# Altium schematic sheet Sheet2.SchDoc
size A4
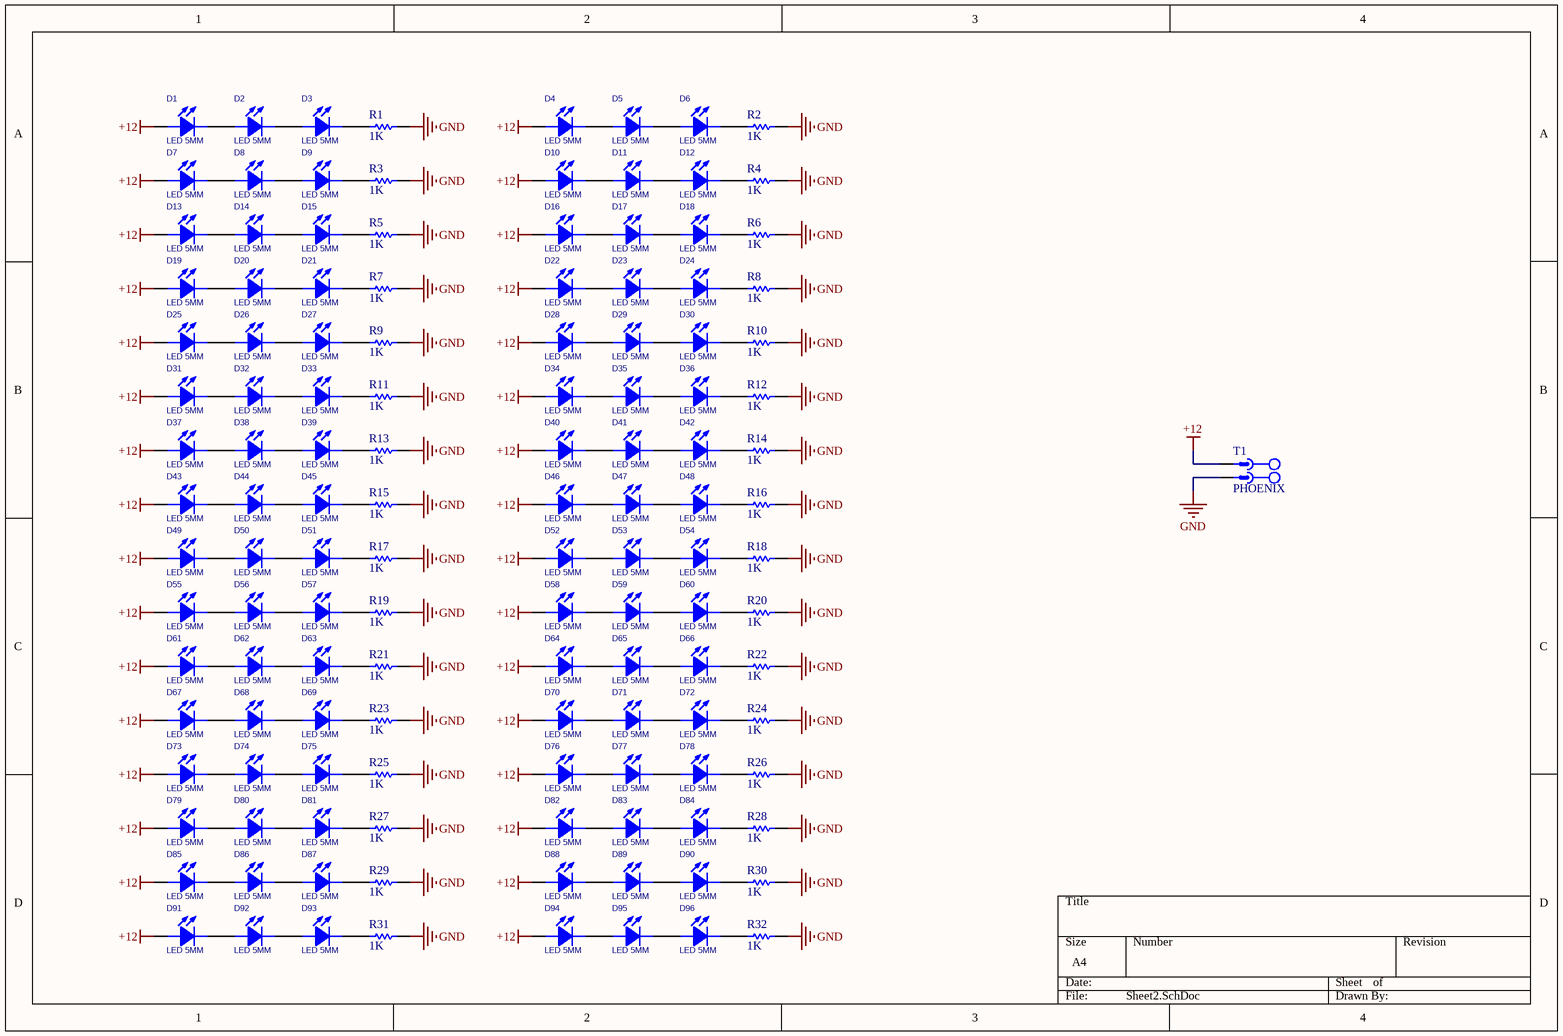
[diagram p0: Sheet2.SchDoc]

## Parts
D1  LED 5MM  [LED5MM_BLUE]
D2  LED 5MM  [LED5MM_BLUE]
D3  LED 5MM  [LED5MM_BLUE]
D4  LED 5MM  [LED5MM_BLUE]
D5  LED 5MM  [LED5MM_BLUE]
D6  LED 5MM  [LED5MM_BLUE]
D7  LED 5MM  [LED5MM_BLUE]
D8  LED 5MM  [LED5MM_BLUE]
D9  LED 5MM  [LED5MM_BLUE]
D10  LED 5MM  [LED5MM_BLUE]
D11  LED 5MM  [LED5MM_BLUE]
D12  LED 5MM  [LED5MM_BLUE]
D13  LED 5MM  [LED5MM_BLUE]
D14  LED 5MM  [LED5MM_BLUE]
D15  LED 5MM  [LED5MM_BLUE]
D16  LED 5MM  [LED5MM_BLUE]
D17  LED 5MM  [LED5MM_BLUE]
D18  LED 5MM  [LED5MM_BLUE]
D19  LED 5MM  [LED5MM_BLUE]
D20  LED 5MM  [LED5MM_BLUE]
D21  LED 5MM  [LED5MM_BLUE]
D22  LED 5MM  [LED5MM_BLUE]
D23  LED 5MM  [LED5MM_BLUE]
D24  LED 5MM  [LED5MM_BLUE]
D25  LED 5MM  [LED5MM_BLUE]
D26  LED 5MM  [LED5MM_BLUE]
D27  LED 5MM  [LED5MM_BLUE]
D28  LED 5MM  [LED5MM_BLUE]
D29  LED 5MM  [LED5MM_BLUE]
D30  LED 5MM  [LED5MM_BLUE]
D31  LED 5MM  [LED5MM_BLUE]
D32  LED 5MM  [LED5MM_BLUE]
D33  LED 5MM  [LED5MM_BLUE]
D34  LED 5MM  [LED5MM_BLUE]
D35  LED 5MM  [LED5MM_BLUE]
D36  LED 5MM  [LED5MM_BLUE]
D37  LED 5MM  [LED5MM_BLUE]
D38  LED 5MM  [LED5MM_BLUE]
D39  LED 5MM  [LED5MM_BLUE]
D40  LED 5MM  [LED5MM_BLUE]
D41  LED 5MM  [LED5MM_BLUE]
D42  LED 5MM  [LED5MM_BLUE]
D43  LED 5MM  [LED5MM_BLUE]
D44  LED 5MM  [LED5MM_BLUE]
D45  LED 5MM  [LED5MM_BLUE]
D46  LED 5MM  [LED5MM_BLUE]
D47  LED 5MM  [LED5MM_BLUE]
D48  LED 5MM  [LED5MM_BLUE]
D49  LED 5MM  [LED5MM_BLUE]
D50  LED 5MM  [LED5MM_BLUE]
D51  LED 5MM  [LED5MM_BLUE]
D52  LED 5MM  [LED5MM_BLUE]
D53  LED 5MM  [LED5MM_BLUE]
D54  LED 5MM  [LED5MM_BLUE]
D55  LED 5MM  [LED5MM_BLUE]
D56  LED 5MM  [LED5MM_BLUE]
D57  LED 5MM  [LED5MM_BLUE]
D58  LED 5MM  [LED5MM_BLUE]
D59  LED 5MM  [LED5MM_BLUE]
D60  LED 5MM  [LED5MM_BLUE]
D61  LED 5MM  [LED5MM_BLUE]
D62  LED 5MM  [LED5MM_BLUE]
D63  LED 5MM  [LED5MM_BLUE]
D64  LED 5MM  [LED5MM_BLUE]
D65  LED 5MM  [LED5MM_BLUE]
D66  LED 5MM  [LED5MM_BLUE]
D67  LED 5MM  [LED5MM_BLUE]
D68  LED 5MM  [LED5MM_BLUE]
D69  LED 5MM  [LED5MM_BLUE]
D70  LED 5MM  [LED5MM_BLUE]
D71  LED 5MM  [LED5MM_BLUE]
D72  LED 5MM  [LED5MM_BLUE]
D73  LED 5MM  [LED5MM_BLUE]
D74  LED 5MM  [LED5MM_BLUE]
D75  LED 5MM  [LED5MM_BLUE]
D76  LED 5MM  [LED5MM_BLUE]
D77  LED 5MM  [LED5MM_BLUE]
D78  LED 5MM  [LED5MM_BLUE]
D79  LED 5MM  [LED5MM_BLUE]
D80  LED 5MM  [LED5MM_BLUE]
D81  LED 5MM  [LED5MM_BLUE]
D82  LED 5MM  [LED5MM_BLUE]
D83  LED 5MM  [LED5MM_BLUE]
D84  LED 5MM  [LED5MM_BLUE]
D85  LED 5MM  [LED5MM_BLUE]
D86  LED 5MM  [LED5MM_BLUE]
D87  LED 5MM  [LED5MM_BLUE]
D88  LED 5MM  [LED5MM_BLUE]
D89  LED 5MM  [LED5MM_BLUE]
D90  LED 5MM  [LED5MM_BLUE]
D91  LED 5MM  [LED5MM_BLUE]
D92  LED 5MM  [LED5MM_BLUE]
D93  LED 5MM  [LED5MM_BLUE]
D94  LED 5MM  [LED5MM_BLUE]
D95  LED 5MM  [LED5MM_BLUE]
D96  LED 5MM  [LED5MM_BLUE]
R1  1K  [Axial 0_25 W, 0_4 IN LEAD PITCH]
R2  1K  [Axial 0_25 W, 0_4 IN LEAD PITCH]
R3  1K  [Axial 0_25 W, 0_4 IN LEAD PITCH]
R4  1K  [Axial 0_25 W, 0_4 IN LEAD PITCH]
R5  1K  [Axial 0_25 W, 0_4 IN LEAD PITCH]
R6  1K  [Axial 0_25 W, 0_4 IN LEAD PITCH]
R7  1K  [Axial 0_25 W, 0_4 IN LEAD PITCH]
R8  1K  [Axial 0_25 W, 0_4 IN LEAD PITCH]
R9  1K  [Axial 0_25 W, 0_4 IN LEAD PITCH]
R10  1K  [Axial 0_25 W, 0_4 IN LEAD PITCH]
R11  1K  [Axial 0_25 W, 0_4 IN LEAD PITCH]
R12  1K  [Axial 0_25 W, 0_4 IN LEAD PITCH]
R13  1K  [Axial 0_25 W, 0_4 IN LEAD PITCH]
R14  1K  [Axial 0_25 W, 0_4 IN LEAD PITCH]
R15  1K  [Axial 0_25 W, 0_4 IN LEAD PITCH]
R16  1K  [Axial 0_25 W, 0_4 IN LEAD PITCH]
R17  1K  [Axial 0_25 W, 0_4 IN LEAD PITCH]
R18  1K  [Axial 0_25 W, 0_4 IN LEAD PITCH]
R19  1K  [Axial 0_25 W, 0_4 IN LEAD PITCH]
R20  1K  [Axial 0_25 W, 0_4 IN LEAD PITCH]
R21  1K  [Axial 0_25 W, 0_4 IN LEAD PITCH]
R22  1K  [Axial 0_25 W, 0_4 IN LEAD PITCH]
R23  1K  [Axial 0_25 W, 0_4 IN LEAD PITCH]
R24  1K  [Axial 0_25 W, 0_4 IN LEAD PITCH]
R25  1K  [Axial 0_25 W, 0_4 IN LEAD PITCH]
R26  1K  [Axial 0_25 W, 0_4 IN LEAD PITCH]
R27  1K  [Axial 0_25 W, 0_4 IN LEAD PITCH]
R28  1K  [Axial 0_25 W, 0_4 IN LEAD PITCH]
R29  1K  [Axial 0_25 W, 0_4 IN LEAD PITCH]
R30  1K  [Axial 0_25 W, 0_4 IN LEAD PITCH]
R31  1K  [Axial 0_25 W, 0_4 IN LEAD PITCH]
R32  1K  [Axial 0_25 W, 0_4 IN LEAD PITCH]
T1  PHOENIX  [MSTB 2,5/2-G-5,08]

## Nets
+12: D1.1(ANODE) D4.1(ANODE) D7.1(ANODE) D10.1(ANODE) D13.1(ANODE) D16.1(ANODE) D19.1(ANODE) D22.1(ANODE) D25.1(ANODE) D28.1(ANODE) D31.1(ANODE) D34.1(ANODE) D37.1(ANODE) D40.1(ANODE) D43.1(ANODE) D46.1(ANODE) D49.1(ANODE) D52.1(ANODE) D55.1(ANODE) D58.1(ANODE) D61.1(ANODE) D64.1(ANODE) D67.1(ANODE) D70.1(ANODE) D73.1(ANODE) D76.1(ANODE) D79.1(ANODE) D82.1(ANODE) D85.1(ANODE) D88.1(ANODE) D91.1(ANODE) D94.1(ANODE) T1.1
GND: R1.2 R2.2 R3.2 R4.2 R5.2 R6.2 R7.2 R8.2 R9.2 R10.2 R11.2 R12.2 R13.2 R14.2 R15.2 R16.2 R17.2 R18.2 R19.2 R20.2 R21.2 R22.2 R23.2 R24.2 R25.2 R26.2 R27.2 R28.2 R29.2 R30.2 R31.2 R32.2 T1.2
NetD1_2: D1.2(CATHODE) D2.1(ANODE)
NetD2_2: D2.2(CATHODE) D3.1(ANODE)
NetD3_2: D3.2(CATHODE) R1.1
NetD4_2: D4.2(CATHODE) D5.1(ANODE)
NetD5_2: D5.2(CATHODE) D6.1(ANODE)
NetD6_2: D6.2(CATHODE) R2.1
NetD7_2: D7.2(CATHODE) D8.1(ANODE)
NetD8_2: D8.2(CATHODE) D9.1(ANODE)
NetD9_2: D9.2(CATHODE) R3.1
NetD10_2: D10.2(CATHODE) D11.1(ANODE)
NetD11_2: D11.2(CATHODE) D12.1(ANODE)
NetD12_2: D12.2(CATHODE) R4.1
NetD13_2: D13.2(CATHODE) D14.1(ANODE)
NetD14_2: D14.2(CATHODE) D15.1(ANODE)
NetD15_2: D15.2(CATHODE) R5.1
NetD16_2: D16.2(CATHODE) D17.1(ANODE)
NetD17_2: D17.2(CATHODE) D18.1(ANODE)
NetD18_2: D18.2(CATHODE) R6.1
NetD19_2: D19.2(CATHODE) D20.1(ANODE)
NetD20_2: D20.2(CATHODE) D21.1(ANODE)
NetD21_2: D21.2(CATHODE) R7.1
NetD22_2: D22.2(CATHODE) D23.1(ANODE)
NetD23_2: D23.2(CATHODE) D24.1(ANODE)
NetD24_2: D24.2(CATHODE) R8.1
NetD25_2: D25.2(CATHODE) D26.1(ANODE)
NetD26_2: D26.2(CATHODE) D27.1(ANODE)
NetD27_2: D27.2(CATHODE) R9.1
NetD28_2: D28.2(CATHODE) D29.1(ANODE)
NetD29_2: D29.2(CATHODE) D30.1(ANODE)
NetD30_2: D30.2(CATHODE) R10.1
NetD31_2: D31.2(CATHODE) D32.1(ANODE)
NetD32_2: D32.2(CATHODE) D33.1(ANODE)
NetD33_2: D33.2(CATHODE) R11.1
NetD34_2: D34.2(CATHODE) D35.1(ANODE)
NetD35_2: D35.2(CATHODE) D36.1(ANODE)
NetD36_2: D36.2(CATHODE) R12.1
NetD37_2: D37.2(CATHODE) D38.1(ANODE)
NetD38_2: D38.2(CATHODE) D39.1(ANODE)
NetD39_2: D39.2(CATHODE) R13.1
NetD40_2: D40.2(CATHODE) D41.1(ANODE)
NetD41_2: D41.2(CATHODE) D42.1(ANODE)
NetD42_2: D42.2(CATHODE) R14.1
NetD43_2: D43.2(CATHODE) D44.1(ANODE)
NetD44_2: D44.2(CATHODE) D45.1(ANODE)
NetD45_2: D45.2(CATHODE) R15.1
NetD46_2: D46.2(CATHODE) D47.1(ANODE)
NetD47_2: D47.2(CATHODE) D48.1(ANODE)
NetD48_2: D48.2(CATHODE) R16.1
NetD49_2: D49.2(CATHODE) D50.1(ANODE)
NetD50_2: D50.2(CATHODE) D51.1(ANODE)
NetD51_2: D51.2(CATHODE) R17.1
NetD52_2: D52.2(CATHODE) D53.1(ANODE)
NetD53_2: D53.2(CATHODE) D54.1(ANODE)
NetD54_2: D54.2(CATHODE) R18.1
NetD55_2: D55.2(CATHODE) D56.1(ANODE)
NetD56_2: D56.2(CATHODE) D57.1(ANODE)
NetD57_2: D57.2(CATHODE) R19.1
NetD58_2: D58.2(CATHODE) D59.1(ANODE)
NetD59_2: D59.2(CATHODE) D60.1(ANODE)
NetD60_2: D60.2(CATHODE) R20.1
NetD61_2: D61.2(CATHODE) D62.1(ANODE)
NetD62_2: D62.2(CATHODE) D63.1(ANODE)
NetD63_2: D63.2(CATHODE) R21.1
NetD64_2: D64.2(CATHODE) D65.1(ANODE)
NetD65_2: D65.2(CATHODE) D66.1(ANODE)
NetD66_2: D66.2(CATHODE) R22.1
NetD67_2: D67.2(CATHODE) D68.1(ANODE)
NetD68_2: D68.2(CATHODE) D69.1(ANODE)
NetD69_2: D69.2(CATHODE) R23.1
NetD70_2: D70.2(CATHODE) D71.1(ANODE)
NetD71_2: D71.2(CATHODE) D72.1(ANODE)
NetD72_2: D72.2(CATHODE) R24.1
NetD73_2: D73.2(CATHODE) D74.1(ANODE)
NetD74_2: D74.2(CATHODE) D75.1(ANODE)
NetD75_2: D75.2(CATHODE) R25.1
NetD76_2: D76.2(CATHODE) D77.1(ANODE)
NetD77_2: D77.2(CATHODE) D78.1(ANODE)
NetD78_2: D78.2(CATHODE) R26.1
NetD79_2: D79.2(CATHODE) D80.1(ANODE)
NetD80_2: D80.2(CATHODE) D81.1(ANODE)
NetD81_2: D81.2(CATHODE) R27.1
NetD82_2: D82.2(CATHODE) D83.1(ANODE)
NetD83_2: D83.2(CATHODE) D84.1(ANODE)
NetD84_2: D84.2(CATHODE) R28.1
NetD85_2: D85.2(CATHODE) D86.1(ANODE)
NetD86_2: D86.2(CATHODE) D87.1(ANODE)
NetD87_2: D87.2(CATHODE) R29.1
NetD88_2: D88.2(CATHODE) D89.1(ANODE)
NetD89_2: D89.2(CATHODE) D90.1(ANODE)
NetD90_2: D90.2(CATHODE) R30.1
NetD91_2: D91.2(CATHODE) D92.1(ANODE)
NetD92_2: D92.2(CATHODE) D93.1(ANODE)
NetD93_2: D93.2(CATHODE) R31.1
NetD94_2: D94.2(CATHODE) D95.1(ANODE)
NetD95_2: D95.2(CATHODE) D96.1(ANODE)
NetD96_2: D96.2(CATHODE) R32.1

## Library data of the parts
D1-D96 = LED 5MM: Light Emitting Diode; Designer: Abbas Basereh; Data: 16-12-2016; Link: *; Part.No: *
R1-R32 = RES Axial 0.25W: Designer: Abbas Basereh; Desc.: RES Axial 0.25W; Data: 4-1-2017
T1 = CON_Phoenix_MSTB_02: 2 Pitch: 5.08 mm Color: green Contact surface: Tin Assembly; Manufacturer: PHOENIX CONTACT; Connector type: PCB Terminal Block; designer: ABBAS BASEREH; Max Current: 12 A; Positions: 2; Voltage: 320 V; Category: Connector; ComponentLink1Description: Header, Nominal current: 12 A Rated voltage (III/2): 320 V Number of positions: 2 Pitch: 5.08 mm Color: green Contact surface: Tin Assembly: Soldering  DESIGNER:ABBAS BASEREH; ComponentLink2Description: Reference; Mounting Technology: Through-Hole; Pin Count: 2; Revision 1: 2017-3-1; Status: Unreleased; PART.NO: PHOENIX